# EAGLE design SpectrumPlusKeyboard_Kombi (EAGLE 7.6.0)
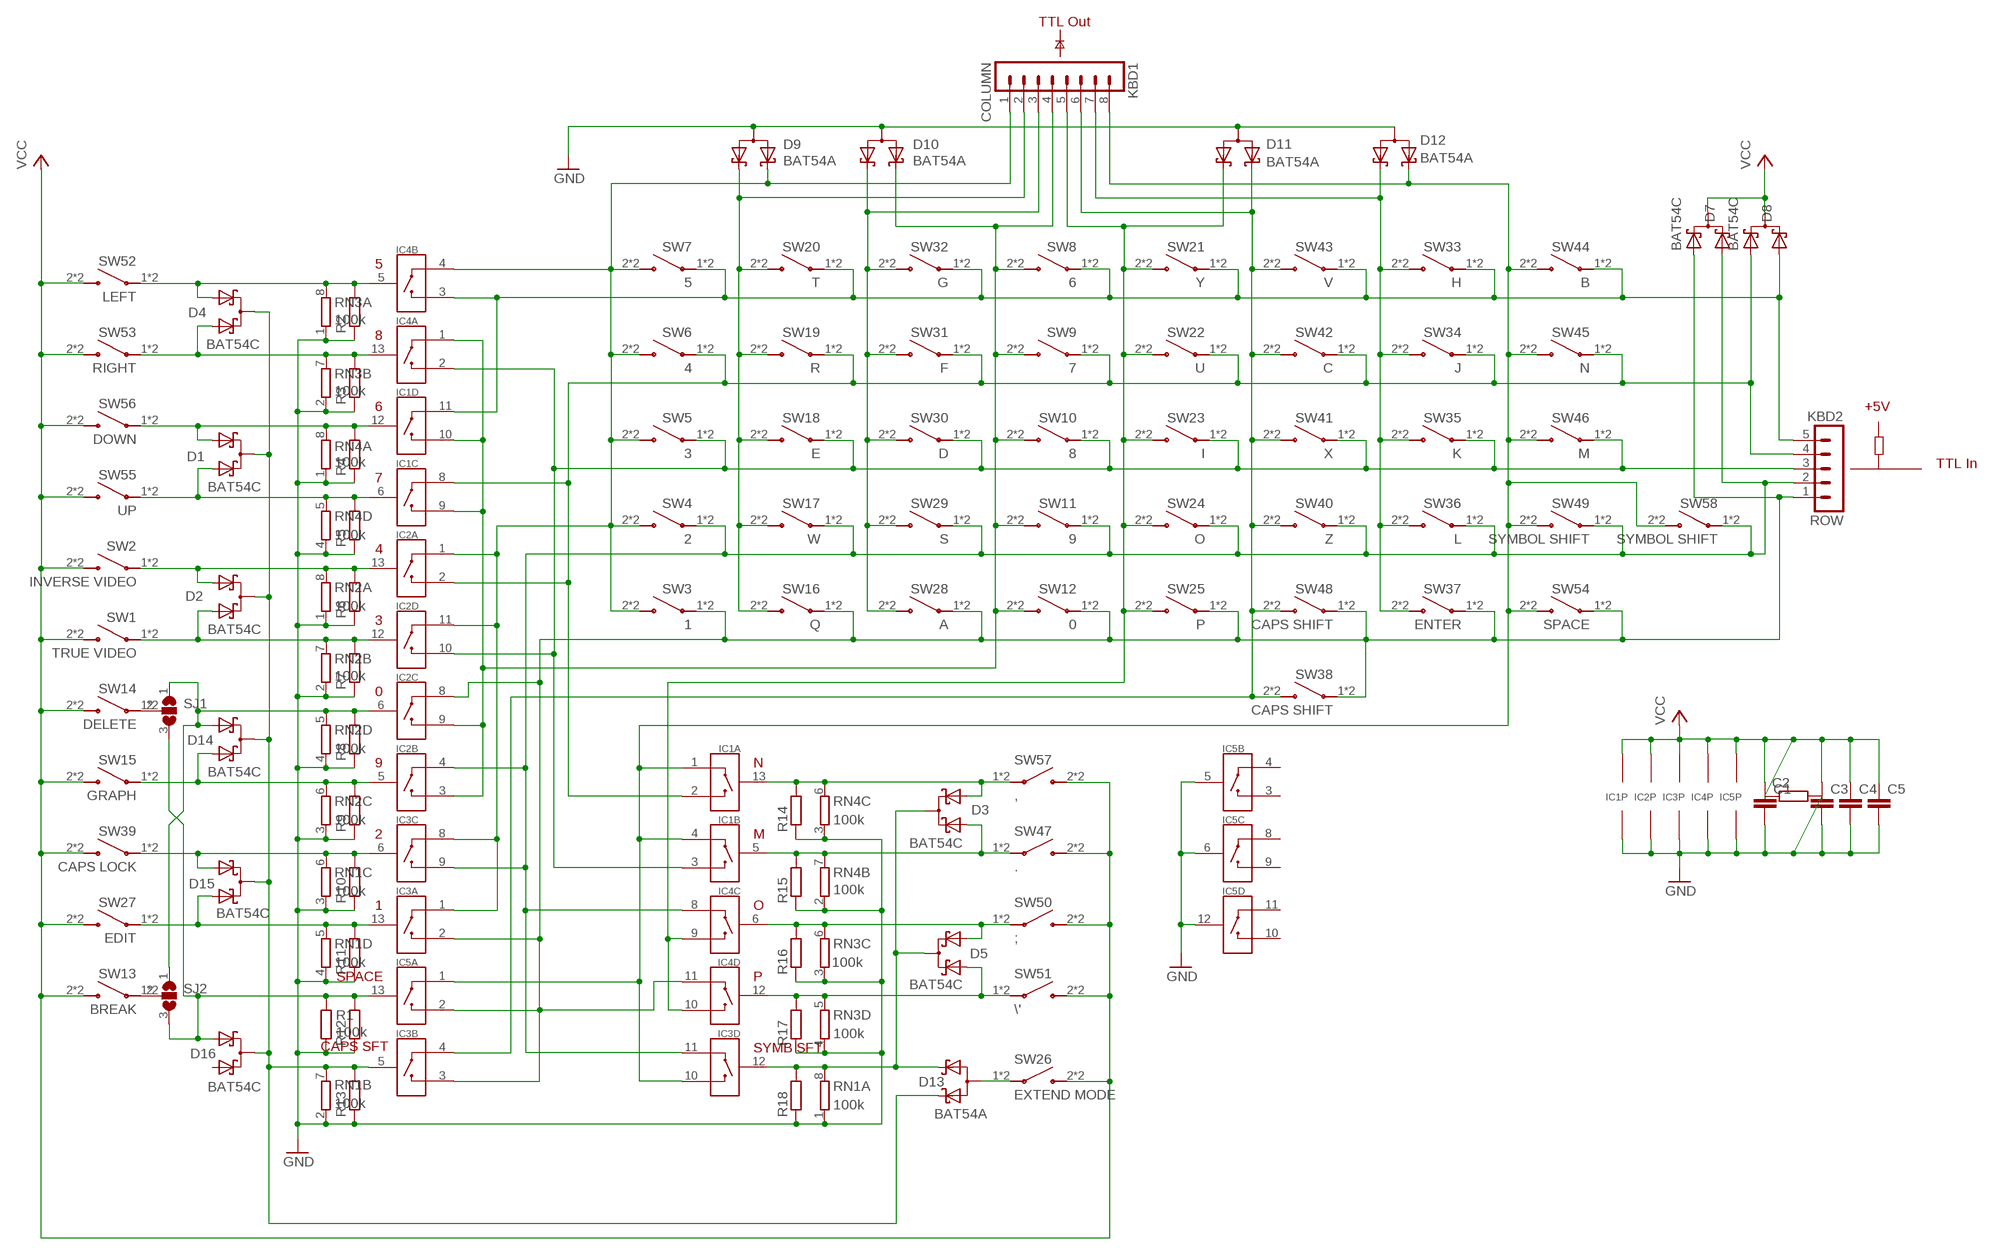
[diagram p0: schematic, sheet 1]

## Parts
C1  C-EUC0805  [C0805]
C2  R-EU_R0805  [R0805]
C3  C-EUC0805  [C0805]
C4  C-EUC0805  [C0805]
C5  C-EUC0805  [C0805]
D1  BAT54C  [SOT-23]
D2  BAT54C  [SOT-23]
D3  BAT54C  [SOT-23]
D4  BAT54C  [SOT-23]
D5  BAT54C  [SOT-23]
D7  BAT54C  [SOT-23]
D8  BAT54C  [SOT-23]
D9  BAT54A  [SOT-23]
D10  BAT54A  [SOT-23]
D11  BAT54A  [SOT-23]
D12  BAT54A  [SOT-23]
D13  BAT54A  [SOT-23]
D14  BAT54C  [SOT-23]
D15  BAT54C  [SOT-23]
D16  BAT54C  [SOT-23]
IC1  4066  [SO14]
IC2  4066  [SO14]
IC3  4066  [SO14]
IC4  4066  [SO14]
IC5  4066  [SO14]
KBD1  COLUMN  MA08-1  [MA08-1]
KBD2  ROW  MA05-1  [MA05-1]
R1  100k  R-EU_R0805  [R0805]
R2  R-EU_R0805  [R0805]
R3  R-EU_R0805  [R0805]
R4  R-EU_R0805  [R0805]
R5  R-EU_R0805  [R0805]
R6  R-EU_R0805  [R0805]
R7  R-EU_R0805  [R0805]
R8  R-EU_R0805  [R0805]
R9  R-EU_R0805  [R0805]
R10  R-EU_R0805  [R0805]
R11  R-EU_R0805  [R0805]
R12  R-EU_R0805  [R0805]
R13  R-EU_R0805  [R0805]
R14  R-EU_R0805  [R0805]
R15  R-EU_R0805  [R0805]
R16  R-EU_R0805  [R0805]
R17  R-EU_R0805  [R0805]
R18  R-EU_R0805  [R0805]
RN1  100k  4R-N0603-ARC  [0603-ARC]
RN2  100k  4R-N0603-ARC  [0603-ARC]
RN3  100k  4R-N0603-ARC  [0603-ARC]
RN4  100k  4R-N0603-ARC  [0603-ARC]
SJ1  SJ2W  [SJ_2]
SJ2  SJ2W  [SJ_2]
SW1  TRUE VIDEO  CHERRY_MXZX_1U_KOMBI  [ZX_1U_KOMBI]
SW2  INVERSE VIDEO  CHERRY_MXZX_1U_KOMBI  [ZX_1U_KOMBI]
SW3  1  CHERRY_MXZX_1U_KOMBI  [ZX_1U_KOMBI]
SW4  2  CHERRY_MXZX_1U_KOMBI  [ZX_1U_KOMBI]
SW5  3  CHERRY_MXZX_1U_KOMBI  [ZX_1U_KOMBI]
SW6  4  CHERRY_MXZX_1U_KOMBI  [ZX_1U_KOMBI]
SW7  5  CHERRY_MXZX_1U_KOMBI  [ZX_1U_KOMBI]
SW8  6  CHERRY_MXZX_1U_KOMBI  [ZX_1U_KOMBI]
SW9  7  CHERRY_MXZX_1U_KOMBI  [ZX_1U_KOMBI]
SW10  8  CHERRY_MXZX_1U_KOMBI  [ZX_1U_KOMBI]
SW11  9  CHERRY_MXZX_1U_KOMBI  [ZX_1U_KOMBI]
SW12  0  CHERRY_MXZX_1U_KOMBI  [ZX_1U_KOMBI]
SW13  BREAK  CHERRY_MXZX_1.5_KOMBI  [ZX_1.5_KOMBI]
SW14  DELETE  CHERRY_MXZX_1.5_KOMBI  [ZX_1.5_KOMBI]
SW15  GRAPH  CHERRY_MXZX_1U_KOMBI  [ZX_1U_KOMBI]
SW16  Q  CHERRY_MXZX_1U_KOMBI  [ZX_1U_KOMBI]
SW17  W  CHERRY_MXZX_1U_KOMBI  [ZX_1U_KOMBI]
SW18  E  CHERRY_MXZX_1U_KOMBI  [ZX_1U_KOMBI]
SW19  R  CHERRY_MXZX_1U_KOMBI  [ZX_1U_KOMBI]
SW20  T  CHERRY_MXZX_1U_KOMBI  [ZX_1U_KOMBI]
SW21  Y  CHERRY_MXZX_1U_KOMBI  [ZX_1U_KOMBI]
SW22  U  CHERRY_MXZX_1U_KOMBI  [ZX_1U_KOMBI]
SW23  I  CHERRY_MXZX_1U_KOMBI  [ZX_1U_KOMBI]
SW24  O  CHERRY_MXZX_1U_KOMBI  [ZX_1U_KOMBI]
SW25  P  CHERRY_MXZX_1U_KOMBI  [ZX_1U_KOMBI]
SW26  EXTEND MODE  CHERRY_MXZX_1.5_KOMBI  [ZX_1.5_KOMBI]
SW27  EDIT  CHERRY_MXZX_1.25U_KOMBI  [ZX_1.25U_KOMBI]
SW28  A  CHERRY_MXZX_1U_KOMBI  [ZX_1U_KOMBI]
SW29  S  CHERRY_MXZX_1U_KOMBI  [ZX_1U_KOMBI]
SW30  D  CHERRY_MXZX_1U_KOMBI  [ZX_1U_KOMBI]
SW31  F  CHERRY_MXZX_1U_KOMBI  [ZX_1U_KOMBI]
SW32  G  CHERRY_MXZX_1U_KOMBI  [ZX_1U_KOMBI]
SW33  H  CHERRY_MXZX_1U_KOMBI  [ZX_1U_KOMBI]
SW34  J  CHERRY_MXZX_1U_KOMBI  [ZX_1U_KOMBI]
SW35  K  CHERRY_MXZX_1U_KOMBI  [ZX_1U_KOMBI]
SW36  L  CHERRY_MXZX_1U_KOMBI  [ZX_1U_KOMBI]
SW37  ENTER  CHERRY_MXZX_ENTER_KOMBI  [ZX_ENTER_KOMBI]
SW38  CAPS SHIFT  CHERRY_MXZX_2.3U_KOMBI  [ZX_2.3U_KOMBI]
SW39  CAPS LOCK  CHERRY_MXZX_1U_KOMBI  [ZX_1U_KOMBI]
SW40  Z  CHERRY_MXZX_1U_KOMBI  [ZX_1U_KOMBI]
SW41  X  CHERRY_MXZX_1U_KOMBI  [ZX_1U_KOMBI]
SW42  C  CHERRY_MXZX_1U_KOMBI  [ZX_1U_KOMBI]
SW43  V  CHERRY_MXZX_1U_KOMBI  [ZX_1U_KOMBI]
SW44  B  CHERRY_MXZX_1U_KOMBI  [ZX_1U_KOMBI]
SW45  N  CHERRY_MXZX_1U_KOMBI  [ZX_1U_KOMBI]
SW46  M  CHERRY_MXZX_1U_KOMBI  [ZX_1U_KOMBI]
SW47  .  CHERRY_MXZX_1U_KOMBI  [ZX_1U_KOMBI]
SW48  CAPS SHIFT  CHERRY_MXZX_2.3U_KOMBI  [ZX_2.3U_KOMBI]
SW49  SYMBOL SHIFT  CHERRY_MXZX_1U_KOMBI  [ZX_1U_KOMBI]
SW50  ;  CHERRY_MXZX_1U_KOMBI  [ZX_1U_KOMBI]
SW51  \'  CHERRY_MXZX_1U_KOMBI  [ZX_1U_KOMBI]
SW52  LEFT  CHERRY_MXZX_1U_KOMBI  [ZX_1U_KOMBI]
SW53  RIGHT  CHERRY_MXZX_1U_KOMBI  [ZX_1U_KOMBI]
SW54  SPACE  CHERRY_MXZX_SPACE_KOMBI  [ZX_SPACE_KOMBI]
SW55  UP  CHERRY_MXZX_1U_KOMBI  [ZX_1U_KOMBI]
SW56  DOWN  CHERRY_MXZX_1U_KOMBI  [ZX_1U_KOMBI]
SW57  ,  CHERRY_MXZX_1U_KOMBI  [ZX_1U_KOMBI]
SW58  SYMBOL SHIFT  CHERRY_MXZX_1U_KOMBI  [ZX_1U_KOMBI]

## Nets
COL1: D9.1(K1) IC2.1(A:IO) IC2.11(D:IO) IC3.1(A:IO) IC3.8(C:IO) IC4.4(B:IO) KBD1.1 SW3.2 SW3.2B SW4.2 SW4.2B SW5.2 SW5.2B SW6.2 SW6.2B SW7.2 SW7.2B
COL2: D9.2(K2) KBD1.2 SW16.2 SW16.2B SW17.2 SW17.2B SW18.2 SW18.2B SW19.2 SW19.2B SW20.2 SW20.2B
COL3: D10.2(K2) KBD1.3 SW28.2 SW28.2B SW29.2 SW29.2B SW30.2 SW30.2B SW31.2 SW31.2B SW32.2 SW32.2B
COL4: D10.1(K1) IC1.9(C:OI) IC1.10(D:OI) IC2.3(B:OI) IC2.9(C:OI) IC4.1(A:IO) KBD1.4 SW8.2 SW8.2B SW9.2 SW9.2B SW10.2 SW10.2B SW11.2 SW11.2B SW12.2 SW12.2B
COL5: D11.1(K1) IC4.9(C:OI) IC4.10(D:OI) KBD1.5 SW21.2 SW21.2B SW22.2 SW22.2B SW23.2 SW23.2B SW24.2 SW24.2B SW25.2 SW25.2B
COL6: D11.2(K2) IC3.4(B:IO) KBD1.6 SW38.2 SW38.2B SW40.2 SW40.2B SW41.2 SW41.2B SW42.2 SW42.2B SW43.2 SW43.2B SW48.2 SW48.2B
COL7: D12.2(K2) KBD1.7 SW33.2 SW33.2B SW34.2 SW34.2B SW35.2 SW35.2B SW36.2 SW36.2B SW37.2 SW37.2B
COL8: D12.1(K1) IC1.1(A:IO) IC1.4(B:IO) IC3.10(D:OI) IC5.1(A:IO) KBD1.8 SW44.2 SW44.2B SW45.2 SW45.2B SW46.2 SW46.2B SW49.2 SW49.2B SW54.2 SW54.2B SW58.2 SW58.2B
GND: C1.2 C2.2 C3.2 C4.2 C5.2 D9.3(AA) D10.3(AA) D11.3(AA) D12.3(AA) IC1.7(P:GND) IC2.7(P:GND) IC3.7(P:GND) IC4.7(P:GND) IC5.5(B:C) IC5.6(C:C) IC5.7(P:GND) IC5.12(D:C) R1.1 R2.1 R3.1 R4.1 R5.1 R6.1 R7.1 R8.1 R9.1 R10.1 R11.1 R12.1 R13.1 R14.1 R15.1 R16.1 R17.1 R18.1 RN1.1 RN1.2 RN1.3 RN1.4 RN2.1 RN2.2 RN2.3 RN2.4 RN3.1 RN3.2 RN3.3 RN3.4 RN4.1 RN4.2 RN4.3 RN4.4
N$1: SJ1.2 SW14.1 SW14.1B
N$2: SJ2.2 SW13.1 SW13.1B
N$25: D13.3(AA) SW26.1 SW26.1B
ROW1: D8.2(A2) IC1.11(D:IO) IC4.3(B:OI) KBD2.5 SW7.1 SW7.1B SW8.1 SW8.1B SW20.1 SW20.1B SW21.1 SW21.1B SW32.1 SW32.1B SW33.1 SW33.1B SW43.1 SW43.1B SW44.1 SW44.1B
ROW2: D8.1(A1) IC1.2(A:OI) IC1.8(C:IO) IC2.2(A:OI) KBD2.4 SW6.1 SW6.1B SW9.1 SW9.1B SW19.1 SW19.1B SW22.1 SW22.1B SW31.1 SW31.1B SW34.1 SW34.1B SW42.1 SW42.1B SW45.1 SW45.1B
ROW3: IC1.3(B:OI) IC2.10(D:OI) IC4.2(A:OI) KBD2.3 SW5.1 SW5.1B SW10.1 SW10.1B SW18.1 SW18.1B SW23.1 SW23.1B SW30.1 SW30.1B SW35.1 SW35.1B SW41.1 SW41.1B SW46.1 SW46.1B
ROW4: D7.2(A2) IC2.4(B:IO) IC3.9(C:OI) IC3.11(D:IO) IC4.8(C:IO) KBD2.2 SW4.1 SW4.1B SW11.1 SW11.1B SW17.1 SW17.1B SW24.1 SW24.1B SW29.1 SW29.1B SW36.1 SW36.1B SW40.1 SW40.1B SW49.1 SW49.1B SW58.1 SW58.1B
ROW5: D7.1(A1) IC2.8(C:IO) IC3.2(A:OI) IC3.3(B:OI) IC4.11(D:IO) IC5.2(A:OI) KBD2.1 SW3.1 SW3.1B SW12.1 SW12.1B SW16.1 SW16.1B SW25.1 SW25.1B SW28.1 SW28.1B SW37.1 SW37.1B SW38.1 SW38.1B SW48.1 SW48.1B SW54.1 SW54.1B
SW0: D14.1(A1) IC2.6(C:C) R8.2 RN2.5 SJ1.1 SJ2.1
SW1: D15.1(A1) IC3.13(A:C) R11.2 RN1.5 SW27.1 SW27.1B
SW2: D15.2(A2) IC3.6(C:C) R10.2 RN1.6 SW39.1 SW39.1B
SW3: D2.2(A2) IC2.12(D:C) R7.2 RN2.7 SW1.1 SW1.1B
SW4: D2.1(A1) IC2.13(A:C) R6.2 RN2.8 SW2.1 SW2.1B
SW5: D4.1(A1) IC4.5(B:C) R2.2 RN3.8 SW52.1 SW52.1B
SW6: D1.1(A1) IC1.12(D:C) R4.2 RN4.8 SW56.1 SW56.1B
SW7: D1.2(A2) IC1.6(C:C) R5.2 RN4.5 SW55.1 SW55.1B
SW8: D4.2(A2) IC4.13(A:C) R3.2 RN3.7 SW53.1 SW53.1B
SW9: D14.2(A2) IC2.5(B:C) R9.2 RN2.6 SW15.1 SW15.1B
SWCSHFT: D1.3(CC) D2.3(CC) D4.3(CC) D13.2(K2) D14.3(CC) D15.3(CC) D16.3(CC) IC3.5(B:C) R13.2 RN1.7
SWM: D3.2(A2) IC1.5(B:C) R15.2 RN4.7 SW47.1 SW47.1B
SWN: D3.1(A1) IC1.13(A:C) R14.2 RN4.6 SW57.1 SW57.1B
SWO: D5.2(A2) IC4.6(C:C) R16.2 RN3.6 SW50.1 SW50.1B
SWP: D5.1(A1) IC4.12(D:C) R17.2 RN3.5 SW51.1 SW51.1B
SWSPC: D16.1(A1) IC5.13(A:C) R1.2 R12.2 SJ1.3 SJ2.3
SWSSHFT: D3.3(CC) D5.3(CC) D13.1(K1) IC3.12(D:C) R18.2 RN1.8
VCC: C1.1 C2.1 C3.1 C4.1 C5.1 D7.3(CC) D8.3(CC) IC1.14(P:VCC) IC2.14(P:VCC) IC3.14(P:VCC) IC4.14(P:VCC) IC5.14(P:VCC) SW1.2 SW1.2B SW2.2 SW2.2B SW13.2 SW13.2B SW14.2 SW14.2B SW15.2 SW15.2B SW26.2 SW26.2B SW27.2 SW27.2B SW39.2 SW39.2B SW47.2 SW47.2B SW50.2 SW50.2B SW51.2 SW51.2B SW52.2 SW52.2B SW53.2 SW53.2B SW55.2 SW55.2B SW56.2 SW56.2B SW57.2 SW57.2B
Unconnected: D16.2(A2) IC5.3(B:OI) IC5.4(B:IO) IC5.8(C:IO) IC5.9(C:OI) IC5.10(D:OI) IC5.11(D:IO)

## Notes on the sheet
- TTL Out
- 5
- 8
- 6 | +5V
- TTL In
- 7
- 4
- 3
- 0
- 9 | N
- 2 | M
- 1 | O
- SPACE | P
- CAPS SFT | SYMB SFT

## Library data of the parts
C1 C3-C5 = Thorsten_rcl:C-EU: CAPACITOR, European symbol
C2 R1-R18 = Thorsten_rcl:R-EU_: RESISTOR, European symbol
D1-D5 D7 D8 D14-D16 = Thorsten_Diode:BAT54C
D9-D13 = Thorsten_Diode:BAT54A
IC1-IC5 = Thorsten_IC:4066
KBD1 = con-lstb:MA08-1: PIN HEADER; OC_FARNELL: unknown; OC_NEWARK: unknown
KBD2 = con-lstb:MA05-1: PIN HEADER; OC_FARNELL: unknown; OC_NEWARK: unknown
RN1-RN4 = resistor-dil:4R-N: Array Chip Resistor Source: RS Component / Phycomp; OC_FARNELL: unknown; OC_NEWARK: unknown
SJ1 SJ2 = jumper:SJ2W: SMD solder JUMPER
SW1-SW58 = Cherry_MX_v7.0:CHERRY_MX

## Board
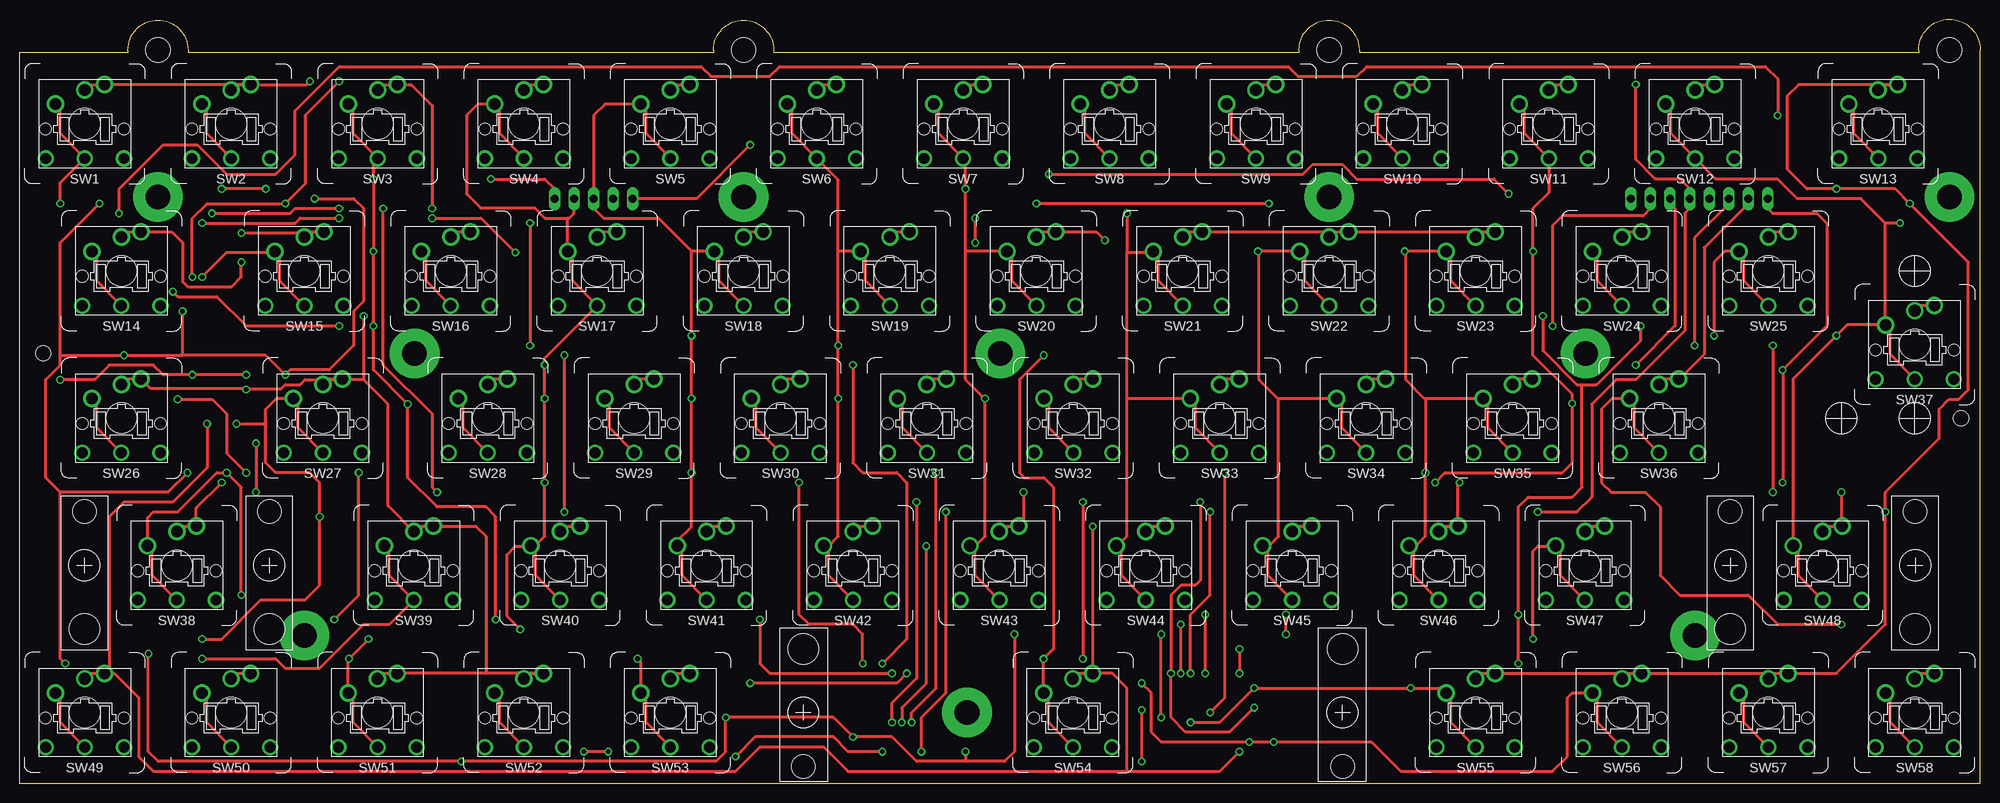
[diagram p1: board, top side]
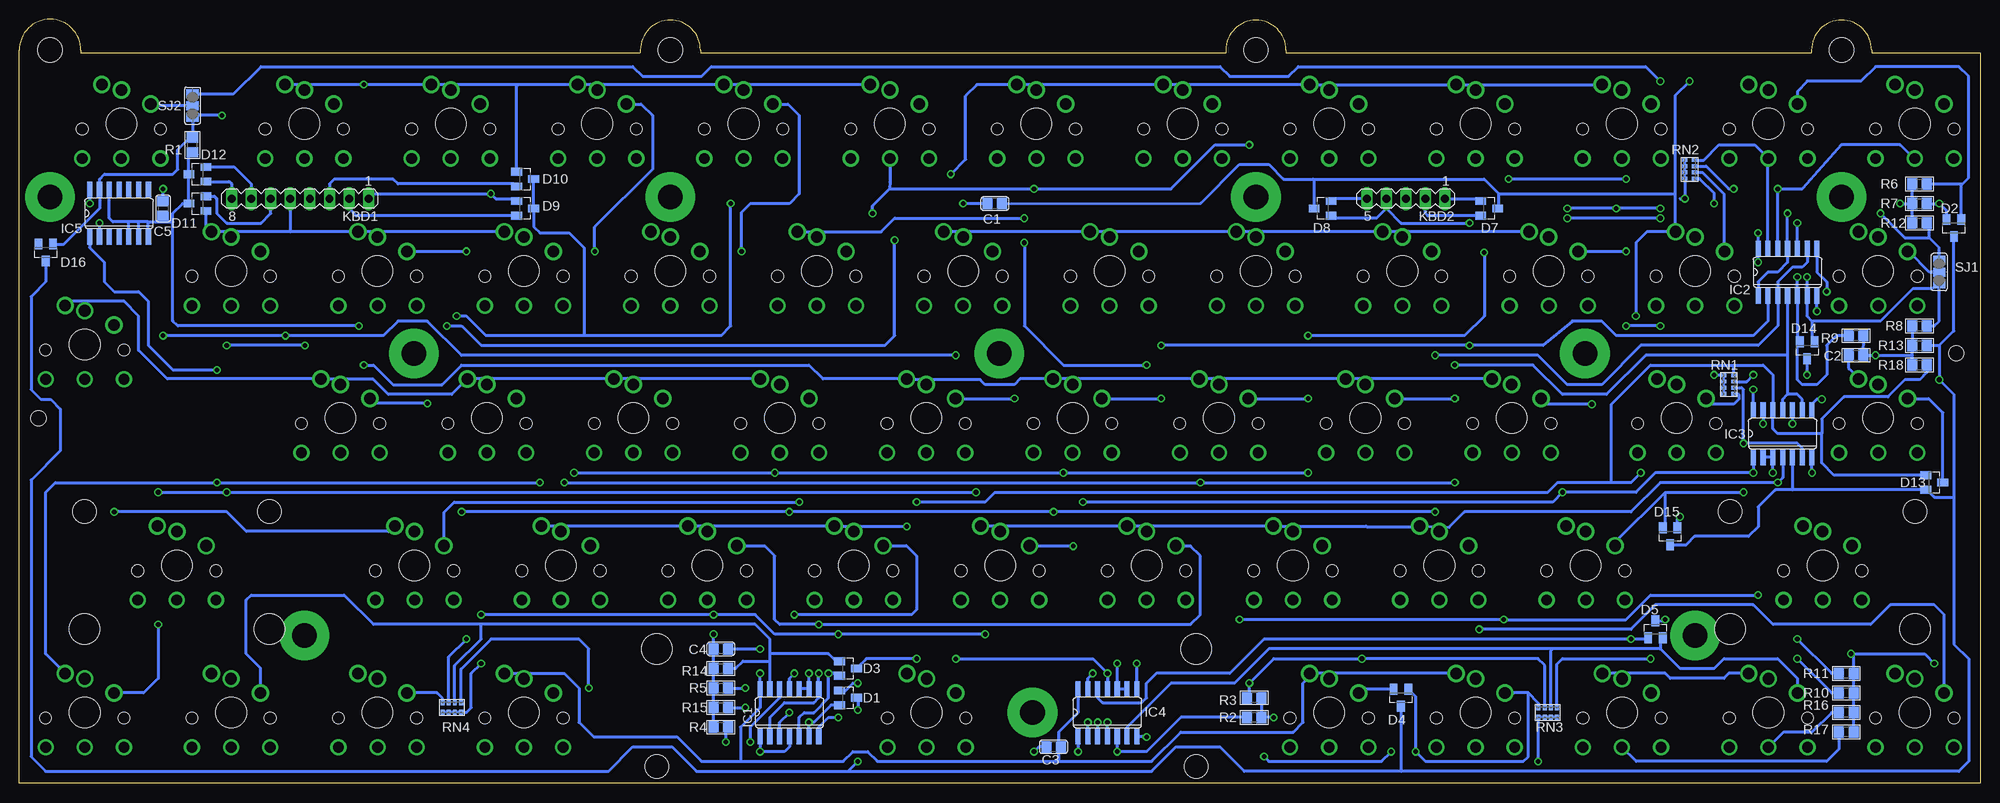
[diagram p2: board, bottom side, seen from below]

Size 254.5 x 99.15 mm. Coordinates in mm from the lower left corner, seen from the top.
Outline: 0,0 254.5,0 254.5,95.15 arc180 246.5,95.15 246.5,94.8 173.9,94.8 173.9,95.15 arc180 166.1,95.15 166.1,94.8 97.9,94.8 97.9,95.15 arc180 90.1,95.15 90.1,94.8 21.9,94.8 21.9,95.15 arc180 14.1,95.15 14.1,94.8 0,94.8 0,0
Copper layers (1*16): Top 0.035mm / dielectric 1.5mm / Bottom 0.035mm
Design rules "default *": minimum track width 10mil, minimum drill 0.015240625mm, track to track 8mil, track to pad 8mil, pad to pad 8mil, via to via 8mil, smd to smd 8mil, copper to edge 20mil, drill to drill 8mil, minimum pad ring 10mil, minimum via ring 8mil, stop-mask expansion 4mil, vias tented up to drill 0mil, thermal gap 10mil
Holes 3.2 mm at 250.5,95.15 170,95.15 94,95.15 18,95.15
Holes 2 mm at 3.1,55.8 252,47.4

### Footprints (pad centres in the part's own frame; a part is rotated, then mirrored left to right if it is on the bottom)
C0805 = smd 1.3 x 1.5: 1 -0.95,0; 2 0.95,0
R0805 = smd 1.3 x 1.5: 1 -0.95,0; 2 0.95,0
SOT-23 = smd 1 x 1.4: 1 -0.95,-1.1; 2 0.95,-1.1; 3 0,1.1
SO14 = smd 0.66 x 2.032: 1 -3.175,-3.073; 2 -1.905,-3.073; 3 -0.635,-3.073; 4 0.635,-3.073; 5 1.905,-3.073; 6 3.175,-3.073; 7 4.445,-3.073; 8 4.445,3.073; 9 3.175,3.073; 10 1.905,3.073; 11 0.635,3.073; 12 -0.635,3.073; 13 -1.905,3.073; 14 -3.175,3.073
MA08-1 = drill 1.016 long: 1 -8.89,0; 2 -6.35,0; 3 -3.81,0; 4 -1.27,0; 5 1.27,0; 6 3.81,0; 7 6.35,0; 8 8.89,0
MA05-1 = drill 1.016 long: 1 -5.08,0; 2 -2.54,0; 3 0,0; 4 2.54,0; 5 5.08,0
0603-ARC = smd 0.5 x 0.65: 1 -1.2,-0.625; 2 -0.4,-0.625; 3 0.4,-0.625; 4 1.2,-0.625; 5 1.2,0.625; 6 0.4,0.625; 7 -0.4,0.625; 8 -1.2,0.625
SJ_2 = smd 1.168 x 1.6: 1 -1.524,0; 2 0,0; 3 1.524,0
ZX_1U_KOMBI = drill 1.5: 1 -3.81,2.54; 2 2.54,5.08; 2B 0,4.38 | drill 1.4: 1B 0,-4.51; J1 5.08,-4.51; J2 -5.08,-4.51 | hole 1.55: 5.08,-0.7; -5.08,-0.7 | hole 4: 0,0
ZX_1.5_KOMBI = drill 1.5: 1 -3.81,2.54; 2 2.54,5.08; 2B 0,4.38 | drill 1.4: 1B 0,-4.51; J1 5.08,-4.51; J2 -5.08,-4.51 | hole 1.55: 5.08,-0.7; -5.08,-0.7 | hole 4: 0,0
ZX_1.25U_KOMBI = drill 1.5: 1 -3.81,2.54; 2 2.54,5.08; 2B 0,4.38 | drill 1.4: 1B 0,-4.51; J1 5.08,-4.51; J2 -5.08,-4.51 | hole 1.55: 5.08,-0.7; -5.08,-0.7 | hole 4: 0,0
ZX_ENTER_KOMBI = drill 1.5: 1 -3.81,2.54; 2 2.54,5.08; 2B 0,4.38 | drill 1.4: 1B 0,-4.51; J1 5.08,-4.51; J2 -5.08,-4.51 | hole 1.55: 5.08,-0.7; -5.08,-0.7 | hole 4: 0,0
ZX_2.3U_KOMBI = drill 1.5: 1 -3.81,2.54; 2 2.54,5.08; 2B 0,4.38 | drill 1.4: 1B 0,-4.51; J1 5.08,-4.51; J2 -5.08,-4.51 | hole 3.05: -12,7; 12,7 | hole 4: -12,-8.24; 12,-8.24; 0,0 | hole 1.55: 5.08,-0.7; -5.08,-0.7
ZX_SPACE_KOMBI = drill 1.5: 1 -3.81,2.54; 2 2.54,5.08; 2B 0,4.38 | drill 1.4: 1B 0,-4.51; J1 5.08,-4.51; J2 -5.08,-4.51 | hole 3.05: -34.99,-7; 34.99,-7 | hole 4: -34.99,8.24; 34.99,8.24; 0,0 | hole 1.55: 5.08,-0.7; -5.08,-0.7

### Placement (x,y rotation side)
C1  127.88,75.24 180 bottom
C2  16.12,55.55 0 bottom
C3  120.26,4.75 180 bottom
C4  163.44,17.45 180 bottom
C5  235.83,74.61 270 bottom
D1  146.93,11.1 270 bottom
D2  3.42,72.06 180 bottom
D3  146.93,14.91 270 bottom
D4  75.17,11.1 180 bottom
D5  42.16,19.99 0 bottom
D7  63.74,74.61 270 bottom
D8  85.33,74.61 90 bottom
D9  188.84,74.61 270 bottom
D10  188.84,78.42 270 bottom
D11  231.38,75.24 90 bottom
D12  231.38,79.05 90 bottom
D13  5.96,39.05 270 bottom
D14  22.47,56.19 180 bottom
D15  40.25,32.06 180 bottom
D16  251.07,68.89 180 bottom
IC1  155.19,9.2 0 bottom
IC2  25.64,66.35 0 bottom
IC3  26.28,45.39 0 bottom
IC4  113.91,9.2 0 bottom
IC5  242.18,73.97 0 bottom
KBD1  218.05,75.88 180 bottom
KBD2  74.54,75.88 180 bottom
R1  232.02,82.86 90 bottom
R2  94.22,8.56 180 bottom
R3  94.22,11.1 180 bottom
R4  163.44,7.29 0 bottom
R5  163.44,12.38 0 bottom
R6  7.87,77.78 0 bottom
R7  7.87,75.24 0 bottom
R8  7.87,59.36 0 bottom
R9  16.12,58.09 180 bottom
R10  17.39,11.74 180 bottom
R11  17.39,14.28 180 bottom
R12  7.87,72.7 0 bottom
R13  7.87,56.83 0 bottom
R14  163.44,14.91 0 bottom
R15  163.44,9.83 0 bottom
R16  17.39,9.2 180 bottom
R17  17.39,6.66 180 bottom
R18  7.87,54.28 0 bottom
RN1  32.63,51.75 270 bottom
RN2  37.71,79.69 270 bottom
RN3  56.12,9.2 0 bottom
RN4  198.37,9.83 0 bottom
SJ1  5.33,66.35 90 bottom
SJ2  232.02,87.94 270 bottom
SW1  8.5,85.6 0 top
SW2  27.5,85.6 0 top
SW3  46.52,85.6 0 top
SW4  65.5,85.6 0 top
SW5  84.5,85.6 0 top
SW6  103.5,85.6 0 top
SW7  122.5,85.6 0 top
SW8  141.5,85.6 0 top
SW9  160.5,85.6 0 top
SW10  179.5,85.6 0 top
SW11  198.5,85.6 0 top
SW12  217.5,85.6 0 top
SW13  241.25,85.6 0 top
SW14  13.25,66.5 0 top
SW15  37,66.5 0 top
SW16  56,66.5 0 top
SW17  75,66.5 0 top
SW18  94,66.5 0 top
SW19  113,66.5 0 top
SW20  132,66.5 0 top
SW21  151,66.5 0 top
SW22  170,66.5 0 top
SW23  189,66.5 0 top
SW24  208,66.5 0 top
SW25  227,66.5 0 top
SW26  13.25,47.4 0 top
SW27  39.4,47.4 0 top
SW28  60.8,47.4 0 top
SW29  79.8,47.4 0 top
SW30  98.8,47.4 0 top
SW31  117.8,47.4 0 top
SW32  136.8,47.4 0 top
SW33  155.8,47.4 0 top
SW34  174.8,47.4 0 top
SW35  193.8,47.4 0 top
SW36  212.8,47.4 0 top
SW37  246,56.95 0 top
SW38  20.45,28.3 0 top
SW39  51.2,28.3 0 top
SW40  70.2,28.3 0 top
SW41  89.2,28.3 0 top
SW42  108.2,28.3 0 top
SW43  127.2,28.3 0 top
SW44  146.2,28.3 0 top
SW45  165.2,28.3 0 top
SW46  184.2,28.3 0 top
SW47  203.2,28.3 0 top
SW48  234.05,28.3 0 top
SW49  8.5,9.2 0 top
SW50  27.5,9.2 0 top
SW51  46.5,9.2 0 top
SW52  65.5,9.2 0 top
SW53  84.5,9.2 0 top
SW54  136.75,9.2 0 top
SW55  189,9.2 0 top
SW56  208,9.2 0 top
SW57  227,9.2 0 top
SW58  246,9.2 0 top

### Tracks (layer width: path | path; a pad name or v marks a point on that pad's centre or on a via)
COL1  (via drill 0.6)
  Top 0.406: v113.28,7.93 113.28,10.47 116.45,13.64 v116.45,36.5 | SW3.2 50.84,90.68 53.59,87.94 v53.59,74.61 | v54.22,37.77 53.59,38.41 53.59,47.94 47.23,54.28 v47.23,74.61 | v25.01,73.97 35.17,73.97 35.8,74.61 v41.52,74.61 | v20.56,49.84 25.01,49.84 26.91,47.94 26.91,42.86 v29.45,40.31 | v133.59,79.05 166.62,79.05 167.88,80.32 171.69,80.32 173.6,78.42 191.38,78.42 v193.28,76.51
  Bottom 0.406: IC4.4 v113.28,7.93 | SW3.2 SW4.2 SW5.2 SW6.2 SW7.2 130.22,90.68 131.69,89.21 131.69,80.95 v133.59,79.05 | v25.01,73.97 IC2.11 25.01,67.62 26.28,66.35 27.55,66.35 28.82,65.08 IC2.1 | v41.52,74.61 v47.23,74.61 v53.59,74.61 | IC3.1 v29.45,40.31 42.16,40.31 44.7,37.77 v54.22,37.77 55.49,36.5 v116.45,36.5 | KBD1.1 208.53,76.51 v193.28,76.51 192.65,75.88 190.26,75.88 D9.1 | v20.56,49.84 21.2,49.84 21.84,49.2 IC3.8
COL2  (via drill 0.6)
  Top 0.406: KBD1.2 211.7,74.61 210.75,73.65 200.27,73.65 199,72.38 v199,59.36 | SW20.2 139.78,71.58 139.94,71.43 v140.9,70.48
  Bottom 0.406: SW16.2 SW17.2 SW18.2 SW19.2 SW20.2 | D9.2 210.75,73.66 211.7,74.61 KBD1.2 | v199,59.36 197.09,59.36 194.56,56.83 142.17,56.83 140.9,58.09 v140.9,70.48
COL3  (via drill 0.6)
  Top 0.406: KBD1.3 214.24,75.24 214.88,74.61 214.88,59.36 v209.79,54.28
  Bottom 0.406: SW28.2 SW29.2 SW30.2 SW31.2 124.61,52.48 125.34,51.75 129.15,51.75 129.78,52.38 139.34,52.38 SW32.2 150.21,52.48 152.01,54.28 197.09,54.28 199.63,51.75 205.99,51.75 208.53,54.28 v209.79,54.28 | D10.2 190.25,77.78 205.35,77.78 205.99,78.42 213.6,78.42 214.24,77.78 KBD1.3
COL4  (via drill 0.6)
  Top 0.406: v197.09,35.23 202.18,35.23 204.08,37.14 204.08,49.2 207.25,52.38 209.79,52.38 216.15,58.73 216.15,73.97 216.78,74.61 KBD1.4 216.78,77.14 215.51,78.42 212.34,78.42 209.79,80.95 v209.79,90.68 | v70.73,55.55 v70.73,35.23 | v117.08,4.12 117.08,8.56 120.26,11.74 v120.26,35.23 | v152.01,14.28 152.01,21.9 154.55,24.44 v154.55,35.23
  Bottom 0.406: SW8.2 SW9.2 SW10.2 190.11,90.68 | 190.11,90.68 SW11.2 v209.79,90.68 SW12.2 | v70.73,35.23 v120.26,35.23 v154.55,35.23 v197.09,35.23 | IC2.9 22.47,67.62 23.11,66.98 24.38,66.98 26.28,65.08 IC2.3 26.28,59.36 28.82,56.83 44.06,56.83 49.14,51.75 53.59,51.75 57.4,55.55 v70.73,55.55 | IC4.1 v117.08,4.12 | v152.01,14.28 IC1.9 IC1.10 | D10.1 189.94,90.51 190.11,90.68
COL5  (via drill 0.6)
  Top 0.406: SW21.2 SW22.2 SW23.2 | v108.19,54.28 108.19,41.58 109.47,40.31 113.91,40.31 115.18,39.05 115.18,18.73 v112,15.55 | v124.07,73.34 v124.07,70.16
  Bottom 0.406: SW23.2 SW24.2 219.32,71.58 | 219.32,71.58 SW25.2 | 229.48,71.64 SW25.2 | v108.19,54.28 118.99,54.28 124.07,59.36 v124.07,70.16 | v112,15.55 IC4.10 IC4.9 | KBD1.5 219.32,71.58 | SW21.2 142.63,71.58 140.9,73.34 v124.07,73.34 | D11.1 230.28,72.33 SW25.2
COL6  (via drill 0.6)
  Top 0.406: SW38.2 22.99,35.75 v26.28,39.05 | v236.47,37.77 236.47,33.5 SW48.2 | v217.41,56.83 217.41,70.8 221.86,75.24 KBD1.6 | v227.57,56.83 v227.57,37.77 | v130.32,37.77 130.32,33.97 SW43.2
  Bottom 0.406: SW43.2 SW42.2 SW41.2 79.67,33.38 79.62,33.33 72.79,33.33 SW40.2 68.93,33.22 66.92,35.23 45.33,35.23 41.52,39.05 v26.28,39.05 25.64,39.68 IC3.4 | v236.47,37.77 v227.57,37.77 v130.32,37.77 | v217.41,56.83 v227.57,56.83 | KBD1.6 221.86,73.97 223.13,72.7 227.57,72.7 228.84,73.97 228.84,75.88 229.16,76.19 D11.2
COL7
  Top 0.406: KBD1.7 224.4,75.24 218.69,69.53 218.69,55.66 215.51,52.48 SW36.2
  Bottom 0.406: SW33.2 SW34.2 SW35.2 196.36,52.48 198.37,50.47 206.62,50.47 208.62,52.48 SW36.2 235.29,52.48 239,56.19 239,60.64 240.91,62.54 248.03,62.54 SW37.2 | D12.2 226.62,80 224.4,77.78 KBD1.7
COL8  (via drill 0.6)
  Top 0.406: 143.75,1.58 143.75,12.38 141.85,14.28 SW54.2 139.31,14.3 v139.31,33.33 | 143.75,1.58 107.56,1.58 104.39,4.75 96.13,4.75 92.95,1.58 17.39,1.58 15.48,3.48 15.48,11.1 12.31,14.28 SW49.2 11.68,14.91 11.68,34.6 13.58,36.5 19.93,36.5 24.38,40.95 v24.38,46.67 | v228.84,39.05 v228.84,53.65 234.56,59.36 234.56,72.7 233.29,73.97 227.57,73.97 226.94,74.61 KBD1.8 | v186.94,39.05 186.74,38.85 SW46.2 186.88,33.38 | 143.75,1.58 155.82,1.58 v158.36,4.12
  Bottom 0.406: SW46.2 SW45.2 SW44.2 139.36,33.38 v139.31,33.33 | v186.94,39.05 v228.84,39.05 249.8,39.05 251.07,37.77 251.07,16.82 SW58.2 | v228.84,53.65 234.56,53.65 237.74,56.83 237.74,62.54 239,63.81 242.18,63.81 243.45,65.08 243.45,67.62 245.35,69.53 IC5.1 | IC3.10 v24.38,46.67 | IC1.1 v158.36,4.12 155.19,4.12 154.55,4.75 IC1.4 | D12.1 227.26,78.1 226.94,77.78 KBD1.8
GND  (via drill 0.6)
  Top 0.406: v21.84,40.31 19.3,37.77 5.33,37.77 | 5.33,37.77 3.42,39.68 3.42,52.38 5.33,54.28 5.33,55.55 | 21.2,55.55 v21.2,61.27 | v16.76,16.82 16.76,4.12 18.02,2.85 v57.4,2.85 90.42,2.85 91.69,4.12 v91.69,8.56 105.66,8.56 v108.19,6.02 113.28,6.02 116.45,2.85 122.8,2.85 | v5.96,15.55 5.33,16.18 5.33,37.77 | 202.81,51.75 202.81,38.41 201.54,37.14 195.82,37.14 194.56,35.87 v194.56,21.9 v194.56,15.55 | v210.43,59.36 210.43,57.46 204.72,51.75 202.81,51.75 | v129.15,19.36 129.15,4.12 127.88,2.85 122.8,2.85 | 21.2,55.55 32,55.55 v34.53,53.02 35.17,53.65 40.25,53.65 43.42,56.83 43.42,61.27 44.7,62.54 44.7,74.61 43.42,75.88 v38.34,75.88 | 5.33,55.55 5.33,70.16 v10.4,75.24 | v148.2,8.56 v148.2,19.36 | v122.8,4.12 122.8,2.85 | 21.2,55.55 v13.58,55.55 5.33,55.55 | v162.17,75.24 v132.01,75.24 | v197.73,60.64 197.73,56.19 202.18,51.75 202.81,51.75 | v164.39,19.36 v164.39,21.9
  Bottom 0.406: v129.15,19.36 v148.2,19.36 156.46,19.36 159,21.9 v164.39,21.9 v194.56,21.9 | v21.2,61.27 IC2.7 | v5.96,15.55 7.23,16.82 v16.76,16.82 16.44,16.5 R11.1 R10.1 R17.1 R16.1 | 237.74,72.87 239,72.87 | 239,72.87 240.28,72.87 | 240.28,72.87 242.35,72.87 242.81,73.34 IC5.12 | IC5.7 237.74,72.87 | IC5.5 240.28,72.87 | IC5.6 239,72.87 | D10.3 D9.3 187.74,72.23 186.94,71.43 183.12,71.43 181.22,69.53 181.22,58.09 | 181.22,58.09 163.44,58.09 162.17,59.36 v162.17,75.24 | 181.22,58.09 193.92,58.09 196.46,60.64 v197.73,60.64 | v210.43,59.36 233.93,59.36 234.56,60 234.56,72.87 | v21.84,40.31 IC3.7 | IC1.7 150.74,7.29 149.47,8.56 v148.2,8.56 | RN1.4 RN1.3 RN1.2 RN1.1 34.47,52.94 v34.53,53.02 | RN3.4 RN3.3 RN3.2 56.75,8.57 56.76,8.56 57.4,8.56 | 57.4,8.56 v57.4,2.85 | v194.56,15.55 195.82,14.28 195.82,9.83 196.45,9.21 RN4.4 RN4.3 RN4.2 RN4.1 | RN3.1 57.38,8.57 57.4,8.56 | 231.38,81.59 R1.1 232.49,81.55 D12.3 D11.3 233.29,75.24 234.56,73.97 234.56,72.87 | C3.2 122.17,4.75 v122.8,4.12 | C1.2 v132.01,75.24 | 237.74,72.87 235.83,72.87 | 235.83,72.87 234.56,72.87 | C5.2 235.83,72.87 | 38.97,75.89 v38.34,75.88 RN2.4 RN2.3 RN2.2 RN2.1 | v108.19,6.02 109.36,6.02 IC4.7 | R18.1 8.81,55.55 | 8.81,55.55 R13.1 R8.1 | v10.4,75.24 R7.1 | R7.1 R6.1 | R12.1 R7.1 | 8.81,55.55 v13.58,55.55 C2.2 15.12,58.05 R9.1 | R4.1 R15.1 R5.1 R14.1 C4.2 164.03,17.18 C4.2 v164.39,19.36 | R3.1 R2.1 v91.69,8.56
N$1
  Bottom 0.406: SJ1.2 6.59,66.35 9.13,68.89 9.29,68.89 SW14.1
N$2
  Bottom 0.406: SJ2.2 237.24,87.94 SW13.1
N$3  (via drill 3.2 pad 6.45)
  other vias: 250.5,76.1
N$4  (via drill 3.2 pad 6.45)
  other vias: 127.3,55.8
N$5  (via drill 3.2 pad 6.45)
  other vias: 123,9.2
N$7  (via drill 3.2 pad 6.45)
  other vias: 37,19.2
N$8  (via drill 3.2 pad 6.45)
  other vias: 170,76.1
N$9  (via drill 3.2 pad 6.45)
  other vias: 94,76.1
N$10  (via drill 3.2 pad 6.45)
  other vias: 51.3,55.8
N$11  (via drill 3.2 pad 6.45)
  other vias: 18,76.1
N$12  (via drill 3.2 pad 6.45)
  other vias: 203.3,55.8
N$13  (via drill 3.2 pad 6.45)
  other vias: 217.5,19.2
N$25
  Bottom 0.406: D13.3 4.86,48.11 6.7,49.94 SW26.1
ROW1  (via drill 0.6)
  Top 0.406: v94.86,82.86 87.88,75.88 KBD2.5 | SW43.1 124.12,30.84 125.34,32.06 v125.34,49.94 125.24,49.94 122.8,52.38 122.8,69.04 | SW20.1 122.8,69.04 | v143.75,73.97 143.75,68.89 | 143.75,68.89 147.04,68.89 SW21.1 | SW33.1 143.75,49.94 | 143.75,49.94 143.75,68.89 | SW44.1 142.53,30.84 143.75,32.06 143.75,49.94 | v117.72,30.79 117.72,13.01 114.55,9.83 v114.55,7.93 | v153.91,14.28 v153.91,21.9 | 122.8,69.04 v122.8,77.14 122.8,80.79 SW7.1B
  Bottom 0.406: SW32.1 v125.34,49.94 | v117.72,30.79 123.34,30.79 SW43.1 | KBD2.5 83.92,75.88 D8.2 | SW44.1 139.36,30.84 138.04,29.52 138.04,22.54 138.68,21.9 v153.91,21.9 | v114.55,7.93 IC4.3 | IC1.11 154.55,13.64 v153.91,14.28 | v143.75,73.97 143.75,74.92 141.53,77.14 | 141.53,77.14 v122.8,77.14 105.02,77.14 99.31,82.86 v94.86,82.86 | SW8.1B 141.5,78.06 141.53,77.14
ROW2  (via drill 0.6)
  Top 0.406: 106.29,68.89 v106.29,56.83 v106.29,49.94 106.29,32.06 105.07,30.84 SW42.1 | SW19.1 106.44,69.04 106.29,68.89 | SW22.1 160.9,69.04 | 160.9,69.04 v160.75,69.04 | SW34.1 163.34,49.94 | 163.34,49.94 160.9,52.38 160.9,69.04 | SW45.1 162.22,30.84 163.44,32.06 163.44,49.84 163.34,49.94 | v150.74,14.28 v150.74,20.63 | v66.28,72.7 v66.28,56.83 | 106.29,68.89 106.29,78.3 SW6.1B
  Bottom 0.406: SW31.1 v106.29,49.94 | SW42.1 104.34,30.79 102.48,30.79 101.21,29.52 101.21,21.9 102.48,20.63 v150.74,20.63 155.82,20.63 156.46,21.27 156.46,29.52 157.72,30.79 161.34,30.79 SW45.1 161.59,30.84 | SW9.1 154.75,88.14 153.28,86.67 153.28,76.51 154.55,75.24 159.63,75.24 160.75,74.12 v160.75,69.04 | v106.29,56.83 v66.28,56.83 56.76,56.83 52.95,60 49.14,60 47.23,58.09 29.45,58.09 27.55,60 IC2.2 | KBD2.4 77.08,74.61 | v150.74,14.28 IC1.8 150.74,11.1 151.38,10.47 155.19,10.47 157.09,8.56 IC1.2 | 77.08,74.61 75.17,72.7 v66.28,72.7 | 77.08,74.61 78.35,73.34 83.92,73.34 D8.1
ROW3  (via drill 0.6)
  Top 0.406: SW5.1 76.01,88.14 74.54,86.67 KBD2.3 74.54,74.61 75.81,73.34 82.94,73.34 87.24,69.04 | SW18.1 87.24,69.04 | 87.24,69.04 v87.24,58.09 v87.24,49.94 v87.24,40.31 87.24,33.33 85.39,31.48 SW41.1 | SW23.1 179.95,69.04 | 179.95,69.04 v179.8,69.04 | SW35.1 182.49,49.94 | 182.49,49.94 182.39,49.94 179.95,52.38 179.95,69.04 | SW46.1 181.27,30.84 182.49,32.06 v182.49,40.31 182.49,49.94 | v23.74,72.7 35.8,72.7 36.44,73.34 v41.52,73.34 | v115.81,7.93 115.81,9.2 118.99,12.38 v118.99,40.31 | v53.59,73.34 59.94,73.34 v64.38,68.89 | v154.55,9.2 156.46,11.1 v156.46,40.31
  Bottom 0.406: SW30.1 v87.24,49.94 | SW10.1 173.8,88.14 172.33,86.67 172.33,79.69 179.8,72.22 v179.8,69.04 | 180.44,30.79 SW46.1 | IC4.2 v115.81,7.93 | v182.49,40.31 v156.46,40.31 v118.99,40.31 v87.24,40.31 | IC2.10 v23.74,72.7 | v41.52,73.34 v53.59,73.34 | v64.38,68.89 64.38,60.64 66.92,58.09 v87.24,58.09 | IC1.3 155.82,7.93 v154.55,9.2
ROW4  (via drill 0.6)
  Top 0.406: SW4.1 59.5,88.14 58.03,86.67 58.03,76.51 59.94,74.61 66.92,74.61 68.19,73.34 71.19,73.34 71.19,73.16 | v65.02,19.99 63.29,21.72 63.29,29.7 64.38,30.79 66.34,30.79 SW40.1 66.97,30.84 68.19,32.06 v68.19,39.05 v68.19,49.94 v68.19,54.28 68.19,55.18 SW17.1B | v183.76,39.05 185.03,40.31 200.27,40.31 201.54,41.58 v201.54,49.3 201.44,49.3 201.54,49.41 201.54,50.47 196.46,55.55 v196.46,69.04 196.46,74.61 198.5,76.64 SW11.1B | 71.19,68.89 SW17.1 71.19,73.16 | 71.19,73.16 72,73.97 KBD2.2 | v109.47,15.55 109.47,19.36 108.19,20.63 102.48,20.63 101.21,21.9 v101.21,39.05 | 194.49,87.94 SW11.1 | SW36.1 206.72,49.94 205.35,48.57 205.35,39.05 206.62,37.77 211.06,37.77 212.97,35.87 212.97,26.98 215.51,24.44 224.4,24.44 228.21,20.63 v236.47,20.63
  Bottom 0.406: SW29.1 v68.19,49.94 | SW24.1 v196.46,69.04 | 72,74.61 KBD2.2 72,73.97 71.69,73.66 D7.2 | v183.76,39.05 v101.21,39.05 v68.19,39.05 | IC2.4 25.01,55.55 | 25.01,55.55 43.42,55.55 48.51,50.47 54.22,50.47 58.03,54.28 v68.19,54.28 | IC3.11 25.64,49.84 25.01,50.47 | SW49.1 4.69,21.9 5.96,23.17 11.68,23.17 14.21,20.63 26.91,20.63 29.45,23.17 42.16,23.17 45.33,19.99 v65.02,19.99 | IC4.8 v109.47,15.55 | IC3.9 23.11,49.84 23.74,50.47 25.01,50.47 | v236.47,20.63 236.47,13.64 238.37,11.74 SW58.1 | 25.01,55.55 25.01,50.47 | v201.54,49.3 208.35,49.3 SW36.1
ROW5  (via drill 0.6)
  Top 0.406: 242.19,72.69 SW37.1 237.22,59.49 v235.83,58.09 230.24,52.5 SW48.1 | 242.19,72.69 239,75.88 230.75,75.88 228.21,78.42 220.18,78.42 SW12.1B | SW54.1 v132.94,16.16 | v132.94,16.16 132.96,16.18 | v61.84,21.27 61.84,34.6 60.57,35.87 54.22,35.87 50.41,39.68 v50.41,49.2 45.97,53.65 v45.97,59.36 v45.97,69.04 v45.97,78.42 45.97,80.53 SW3.1B | SW38.1 16.64,34.48 17.39,35.23 20.56,35.23 25.64,40.31 v26.91,40.31 28.82,38.41 v28.82,24.44 | v244.09,72.7 242.2,72.7 242.19,72.69 | v219.96,58.09 219.96,67.62 221.38,69.04 SW25.1 | v96.13,21.27 96.13,15.55 97.4,14.28 v113.28,14.28 | KBD2.1 69.46,77.14 68.19,78.42 v61.2,78.42 | v132.96,55.55 129.78,52.38 129.78,40.31 130.42,39.68 132.96,39.68 134.23,38.41 134.23,17.45 v132.94,16.16 | v19.93,63.81 20.56,63.17 25.64,63.17 29.45,59.36 v41.52,59.36
  Bottom 0.406: SW16.1 v45.97,69.04 | v28.82,24.44 42.79,24.44 45.97,21.27 v61.84,21.27 v96.13,21.27 | IC4.11 v113.28,14.28 115.16,16.16 v132.94,16.16 | v132.96,55.55 197.09,55.55 201.54,60 205.35,60 207.25,58.09 v219.96,58.09 v235.83,58.09 | IC3.2 IC3.3 v26.91,40.31 | IC5.2 v244.09,72.7 | KBD2.1 65.16,75.88 D7.1 | IC2.8 21.2,66.35 19.93,65.08 v19.93,63.81 | v41.52,59.36 v45.97,59.36 | v50.41,49.2 56.26,49.2 SW28.1 | v45.97,78.42 v61.2,78.42
SW0  (via drill 0.6)
  Top 0.406: v22.47,65.72 22.47,73.34 24.38,75.24 v34.53,75.24 37.08,77.78 37.08,86.67 v41.52,91.12
  Bottom 0.406: 21.84,60 12.95,60 8.75,64.19 6.21,64.19 5.96,64.44 SJ1.1 5.33,60 5.96,59.36 R8.2 | 21.84,60 22.47,60.64 IC2.6 v22.47,65.72 | 21.84,60 21.84,57.61 D14.1 | v34.53,75.24 34.53,76.57 36.45,78.48 RN2.5 | SJ2.1 226.69,89.46 223.13,93.02 174.87,93.02 173.6,91.75 165.98,91.75 164.71,93.02 98.67,93.02 97.4,91.75 89.78,91.75 88.51,93.02 43.42,93.02 v41.52,91.12
SW1  (via drill 0.6)
  Top 0.406: 32,46.67 32,41.58 33.27,40.31 37.71,40.31 38.98,39.05 v38.98,34.6 38.98,25.71 37.08,23.8 31.36,23.8 26.28,18.73 v23.74,18.73 | 32,46.67 32,48.57 33.36,49.94 SW27.1 | v28.18,46.67 32,46.67
  Bottom 0.406: IC3.13 v28.18,46.67 | D15.1 39.3,34.28 v38.98,34.6 | RN1.5 31.43,50.55 31.36,50.47 31.36,49.84 32,49.2 34.86,49.2 SW27.1 | v23.74,18.73 19.3,14.28 R11.2
SW2  (via drill 0.6)
  Top 0.406: v30.73,44.12 v30.73,37.77 | v23.74,16.18 33.27,16.18 34.53,14.91 38.98,14.91 44.7,20.63 48.04,20.63 SW39.1B
  Bottom 0.406: SW39.1 47.39,31.27 40.88,37.77 | 40.88,37.77 v30.73,37.77 | D15.2 41.2,33.65 40.88,33.97 40.88,37.77 | IC3.6 23.11,43.49 23.74,44.12 v30.73,44.12 30.73,51.11 30.96,51.34 RN1.6 | R10.2 19.3,11.74 v23.74,16.18
SW3  (via drill 0.6)
  Top 0.406: v32,77.14 v26.28,77.14 | v5.33,75.24 5.33,77.92 SW1.1B
  Bottom 0.406: IC2.12 v26.28,77.14 23.11,77.14 18.02,82.86 10.4,82.86 8.63,81.09 SW1.1B | RN2.7 35.57,80.09 32.63,77.14 v32,77.14 | D2.2 4.37,74.28 v5.33,75.24 R7.2
SW4
  Bottom 0.406: IC2.13 27.55,81.04 SW2.1B 29.27,82.86 33.9,82.86 35.88,80.89 RN2.8 | SW2.1 23.69,89.8 22.47,91.12 15.48,91.12 13.58,93.02 2.79,93.02 1.51,91.75 1.51,78.56 2.3,77.78 | R6.2 2.3,77.78 | D2.1 2.47,77.61 2.3,77.78
SW5  (via drill 0.6)
  Top 0.406: v112,4.12 107.56,4.12 105.66,6.02 95.5,6.02 v92.95,3.48 | v76.44,4.12 v73.27,4.12
  Bottom 0.406: IC4.5 v112,4.12 108.19,4.12 103.75,8.56 R2.2 | v92.95,3.48 92.32,2.85 77.72,2.85 v76.44,4.12 | D4.1 73.27,11.25 v73.27,4.12 72,2.85 59.3,2.85 58.66,3.48 58.66,11.74 | RN3.8 57.33,10.4 58.66,11.74 | 58.66,11.74 SW52.1 60.57,11.74
SW6  (via drill 0.6)
  Top 0.406: v145.66,13.01 146.93,11.74 146.93,6.66 148.2,5.39 v159.63,5.39 v162.81,5.39 175.5,5.39 179.31,1.58 199,1.58 200.91,3.48 200.91,11.1 201.54,11.74 SW56.1
  Bottom 0.406: D1.1 147.25,12.05 146.29,13.01 v145.66,13.01 | IC1.12 155.82,11.1 159.63,7.29 v159.63,5.39 | RN4.8 199.56,11.04 200.27,11.74 SW56.1 | R4.2 162.81,6.98 v162.81,5.39
SW7  (via drill 0.6)
  Top 0.406: v152.01,7.93 155.82,7.93 v160.26,12.38 v180.59,12.38 184.56,12.38 SW55.1
  Bottom 0.406: IC1.6 v152.01,7.93 151.38,7.93 149.15,10.15 D1.2 | RN4.5 197.16,14.84 193.28,18.73 181.85,18.73 180.59,17.45 v180.59,12.38 | R5.2 v160.26,12.38
SW8  (via drill 0.6)
  Top 0.406: v115.18,14.28 113.91,13.01 v94.86,13.01 | SW53.1 80.69,15.75 v80.25,16.18
  Bottom 0.406: D4.2 80.22,12.2 SW53.1 | IC4.13 115.81,13.64 v115.18,14.28 | RN3.7 56.52,15.31 57.4,16.18 v80.25,16.18 91.69,16.18 v94.86,13.01 94.86,11.74 R3.2
SW9  (via drill 0.6)
  Top 0.406: v23.74,65.72 26.91,68.89 33.04,68.89 SW15.1
  Bottom 0.406: v23.74,65.72 IC2.5 23.74,57.61 D14.2 23.74,56.97 23.74,52.38 23.11,51.75 21.2,51.75 19.93,53.02 19.93,56.83 18.66,58.09 R9.2 | SW15.1 33.27,70.23 33.27,76.51 36.04,79.28 RN2.6
SWCSHFT  (via drill 0.6)
  Top 0.406: v29.45,53.02 v22.47,53.02 18.66,53.02 17.39,54.28 11.68,54.28 9.77,52.38 v5.33,52.38 | v145.66,9.52 v145.66,2.85
  Bottom 0.406: D4.3 75.17,1.58 | 75.17,1.58 95.5,1.58 98.67,4.75 104.39,4.75 107.56,1.58 146.93,1.58 | 146.93,1.58 166.62,1.58 169.79,4.75 174.87,4.75 178.04,1.58 251.07,1.58 252.97,3.48 252.97,39.36 249.16,43.17 249.16,48.57 250.44,49.84 251.71,49.84 252.97,51.11 252.97,63.17 251.07,65.08 D16.3 | 5.33,56.83 3.42,58.73 D2.3 | 5.33,56.83 v5.33,52.38 3.42,50.47 3.42,37.14 | 3.42,37.14 3.42,18.09 1.51,16.18 1.51,2.85 2.79,1.58 75.17,1.58 | 22.3,54.92 D14.3 v22.47,53.02 | 40.08,30.96 D15.3 38.17,30.96 37.08,32.06 30.09,32.06 28.82,33.33 28.82,35.87 26.59,38.09 24.38,38.09 | 3.42,37.14 5.96,37.14 6.92,38.09 D13.2 24.38,38.09 | RN1.7 30.32,52.14 v29.45,53.02 | D1.3 145.66,11.1 v145.66,9.52 | v145.66,2.85 146.93,1.58 | IC3.5 24.38,38.09 | R13.2 5.33,56.83
SWM  (via drill 0.6)
  Top 0.406: v153.28,36.5 153.28,26.34 152.65,25.71 150.74,25.71 149.47,24.44 v149.47,14.28 149.47,8.56 151.38,6.66 157.09,6.66 v160.26,9.83 | v196.46,18.73 196.46,30.15 197.09,30.79 199.34,30.79 SW47.1
  Bottom 0.406: SW47.1 199.39,35.16 198.05,36.5 v153.28,36.5 | D3.2 148.52,13.96 148.84,14.28 v149.47,14.28 149.47,11.1 151.38,9.2 152.65,9.2 153.28,8.56 IC1.5 | RN4.7 198.76,16.42 v196.46,18.73 | R15.2 v160.26,9.83
SWN
  Bottom 0.406: IC1.13 157.09,15.87 | 157.09,15.87 157.09,16.82 | 194.56,20.63 159,20.63 157.09,18.73 157.09,16.82 | 194.56,20.63 208.53,20.63 212.34,24.44 224.4,24.44 225.03,23.8 225.03,16.82 223.19,14.97 SW57.1 | RN4.6 197.97,15.31 194.56,18.73 194.56,20.63 | D3.1 148.51,15.86 149.47,16.82 157.09,16.82 | R14.2 161.53,14.91 160.58,15.87 157.09,15.87
SWO
  Bottom 0.406: IC4.6 110.73,7.29 105.02,13.01 96.77,13.01 92.32,17.45 55.49,17.45 | 41.52,17.45 38.98,14.91 34.53,14.91 33.27,16.18 26.28,16.18 23.74,13.64 23.74,11.79 SW50.1 | 41.05,18.89 D5.2 41.35,18.89 41.52,18.73 41.52,17.45 | 41.52,17.45 55.49,17.45 | RN3.6 55.73,17.22 55.49,17.45 | R16.2 19.3,9.2 21.84,6.66 25.53,6.66 SW50.1B
SWP  (via drill 0.6)
  Top 0.406: v45.33,18.73 v42.79,16.18 42.69,16.09 SW51.1
  Bottom 0.406: D5.1 43.1,18.73 v45.33,18.73 92.95,18.73 97.4,14.28 106.92,14.28 108.19,13.01 108.19,11.1 108.83,10.47 113.91,10.47 114.55,11.1 IC4.12 | RN3.5 54.92,15.48 54.22,16.18 v42.79,16.18 | R17.2 18.34,4.44 19.93,2.85 44.66,2.85 SW51.1B
SWSPC  (via drill 0.6)
  Top 0.406: v12.95,73.97 12.95,77.14 18.66,82.86 23.11,82.86 26.91,79.05 33.27,79.05 35.8,81.59 35.8,87.31 41.52,93.02 88.51,93.02 89.78,91.75 97.4,91.75 98.67,93.02 164.71,93.02 165.98,91.75 173.6,91.75 174.87,93.02 226.62,93.02 228.21,91.43 v228.21,86.67
  Bottom 0.406: D16.1 248.7,69.99 244.09,74.61 IC5.13 244.09,78.42 243.45,79.05 234.56,79.05 233.93,79.69 233.93,82.23 232.66,83.5 231.6,83.5 R1.2 SJ2.3 231.77,86.67 v228.21,86.67 | SJ1.3 5.33,69.53 6.59,70.8 | v12.95,73.97 9.77,70.8 6.59,70.8 | 6.59,70.8 6.59,72.38 R12.2
SWSSHFT  (via drill 0.6)
  Top 0.406: v40.88,21.27 44.06,24.44 v44.06,40.31 | v138.04,36.5 v138.04,16.18
  Bottom 0.406: v44.06,40.31 45.33,39.05 47.87,39.05 | 47.87,39.05 54.85,39.05 56.12,37.77 127.88,37.77 129.15,36.5 v138.04,36.5 | D5.3 41.05,21.09 v40.88,21.27 | 47.87,39.05 47.87,49.2 42.79,54.28 32,54.28 | 32,54.28 28.18,54.28 26.91,53.02 IC3.12 26.91,46.03 26.28,45.39 20.56,45.39 | D13.1 18.98,40 20.56,41.58 20.56,45.39 | v138.04,16.18 144.56,16.18 D3.3 | RN1.8 32,54.28 | R18.2 6.92,53.33 7.87,52.38 9.77,52.38 11.99,50.16 17.71,50.16 20.56,47.3 20.56,45.39
VCC  (via drill 0.6)
  Top 0.406: SW13.2 230.95,90.68 229.48,89.21 229.48,79.69 232.02,77.14 v235.83,77.14 243.45,77.14 v245.35,75.24 252.97,67.62 252.97,51.11 251.71,49.84 250.44,49.84 249.16,48.57 249.16,44.76 242.18,37.77 v242.18,35.23 242.18,20.63 235.83,14.28 SW57.2 SW56.2 SW55.2 | SW1.2 SW2.2 37.27,90.68 v37.71,91.12 | SW52.2 60.57,14.28 | 60.57,14.28 SW51.2 | v29.45,51.11 29.45,51.21 | 60.57,14.28 60.57,32.06 59.25,33.38 SW39.2 | v158.36,17.45 v158.36,14.28 | SW14.2 19.78,71.58 21.2,70.16 21.2,65.08 21.84,64.44 27.55,64.44 28.82,65.72 v28.82,67.62 | v44.7,60.64 44.7,52.38 | 44.7,52.38 47.87,49.2 47.87,36.01 SW39.2B | 44.7,52.38 42.04,52.38 SW27.2 41.84,52.38 37.08,52.38 36.44,51.75 34.53,51.75 34,51.21 29.45,51.21 | 29.45,51.21 17.06,51.21 SW26.2 | v28.82,71.43 36.44,71.43 36.91,70.95 36.91,70.8 SW15.2B
  Bottom 0.406: SW50.2 32.63,14.28 33.27,13.64 40.25,13.64 40.88,14.28 SW51.2 | v37.71,91.12 39.61,89.21 39.61,76.51 | 39.61,76.51 39.61,72.14 SW15.2 43.27,71.58 44.7,70.16 v44.7,60.64 | v242.18,35.23 227.57,35.23 225.03,32.7 206.62,32.7 205.99,33.33 205.79,33.33 SW47.2 | IC4.14 117.08,9.2 119.62,6.66 119.62,4.75 | SW55.2 183.76,14.28 181.85,12.38 181.85,7.93 179.95,6.02 169.16,6.02 165.98,2.85 160.9,2.85 | 160.9,2.85 147.56,2.85 146.29,4.12 144.39,4.12 143.12,2.85 119.62,2.85 | 119.62,2.85 107.56,2.85 103.75,6.66 89.14,6.66 87.88,7.93 87.88,13.01 87.24,13.64 SW53.2 SW52.2 | v28.82,71.43 IC2.14 v28.82,67.62 | IC3.14 v29.45,51.11 | IC5.14 v245.35,75.24 | 62.48,76.51 39.61,76.51 | 62.48,76.51 64.38,78.42 86.61,78.42 | D7.3 62.48,74.78 62.48,76.51 | 119.62,4.75 119.62,2.85 | 160.9,2.85 160.9,7.29 158.36,9.83 IC1.14 v158.36,14.28 | C1.1 101.16,75.29 96.13,80.32 92.32,80.32 90.42,78.42 86.61,78.42 | D8.3 86.44,78.25 86.61,78.42 | C5.1 v235.83,77.14 | C3.1 119.62,4.75 | SW26.2 17.02,53.78 17.12,53.88 C2.1 | C4.1 v158.36,17.45